# Altium schematic sheet ws2182b LED string.SchDoc
size A4
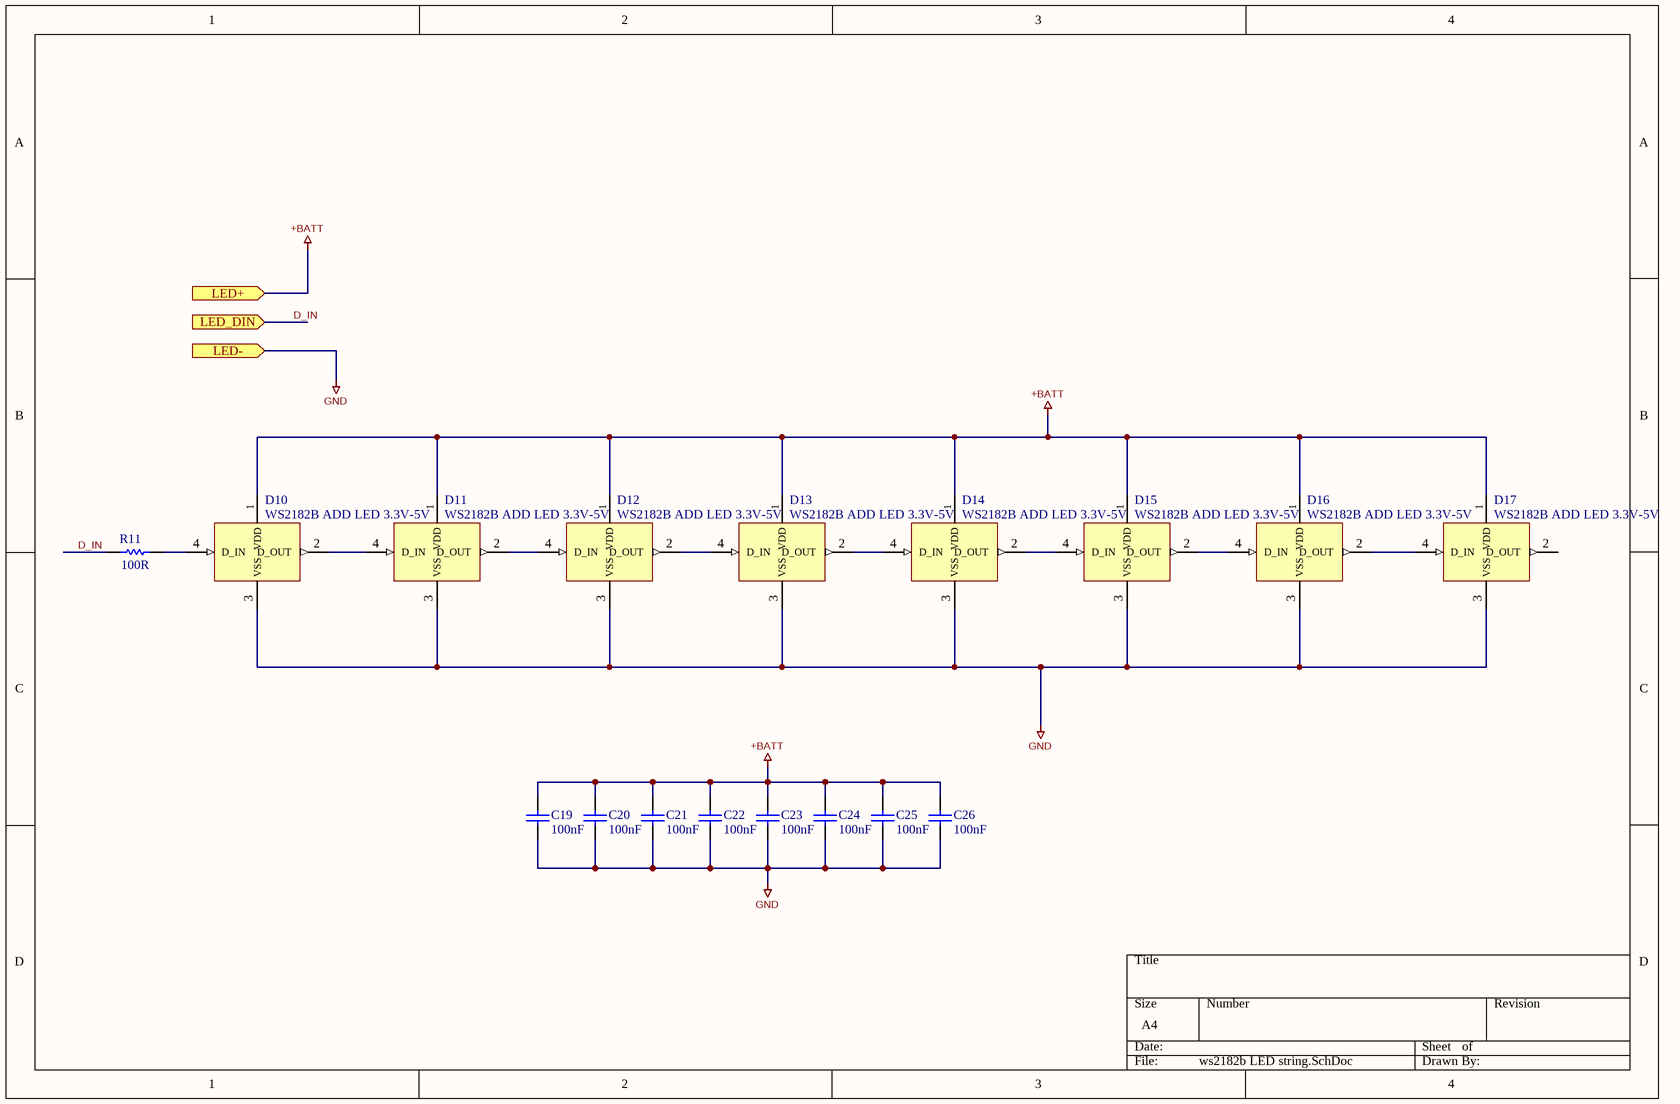
[diagram p0: ws2182b LED string.SchDoc]

## Parts
C19  100nF  [CAPC1608X90X20LL10]
C20  100nF  [CAPC1608X90X20LL10]
C21  100nF  [CAPC1608X90X20LL10]
C22  100nF  [CAPC1608X90X20LL10]
C23  100nF  [CAPC1608X90X20LL10]
C24  100nF  [CAPC1608X90X20LL10]
C25  100nF  [CAPC1608X90X20LL10]
C26  100nF  [CAPC1608X90X20LL10]
D10  WS2182B ADD LED 3.3V-5V  [WS2182B]
D11  WS2182B ADD LED 3.3V-5V  [WS2182B]
D12  WS2182B ADD LED 3.3V-5V  [WS2182B]
D13  WS2182B ADD LED 3.3V-5V  [WS2182B]
D14  WS2182B ADD LED 3.3V-5V  [WS2182B]
D15  WS2182B ADD LED 3.3V-5V  [WS2182B]
D16  WS2182B ADD LED 3.3V-5V  [WS2182B]
D17  WS2182B ADD LED 3.3V-5V  [WS2182B]
R11  100R  [RESC1608X55X25LL10T15]

## Ports
LED+ (in), LED- (in), LED_DIN (in)

## Nets
+BATT: C19.2 C20.2 C21.2 C22.2 C23.2 C24.2 C25.2 C26.2 D10.1(VDD) D11.1(VDD) D12.1(VDD) D13.1(VDD) D14.1(VDD) D15.1(VDD) D16.1(VDD) D17.1(VDD) ; port LED+
GND: C19.1 C20.1 C21.1 C22.1 C23.1 C24.1 C25.1 C26.1 D10.3(VSS) D11.3(VSS) D12.3(VSS) D13.3(VSS) D14.3(VSS) D15.3(VSS) D16.3(VSS) D17.3(VSS) ; port LED-
D_IN: R11.1 ; port LED_DIN
NetD10_2: D10.2(D_OUT) D11.4(D_IN)
NetD10_4: D10.4(D_IN) R11.2
NetD11_2: D11.2(D_OUT) D12.4(D_IN)
NetD12_2: D12.2(D_OUT) D13.4(D_IN)
NetD13_2: D13.2(D_OUT) D14.4(D_IN)
NetD14_2: D14.2(D_OUT) D15.4(D_IN)
NetD15_2: D15.2(D_OUT) D16.4(D_IN)
NetD16_2: D16.2(D_OUT) D17.4(D_IN)

Not connected (* = marked no-connect by the designer): D17 2(D_OUT)

## Library data of the parts
C19-C26 = CMP-2000-07546-1: Chip Capacitor, 0.1 uF, +/- 10%, 50 V, -55 to 125 degC, 0603 (1608 Metric), RoHS, Tape and Reel; Manufacturer: TDK; Voltage: 50V; Dielectric: X7R; Package Reference: 603; Radiation Hardening: No; Composition: Ceramic; Datasheet URL: https://product.tdk.com/info/en/catalog/datasheets/mlcc_automotive_general_en.pdf; Mounting Technology: SurfaceMount; Datasheet Version: 12/2014; Width: 0.8mm; Length: 1.6mm; Capacitance: 100nF; Tolerance: 10%; Case Code (Imperial): 0603; RoHSCompliant: True; Min Operating Temperature: -55degC; Package Description: 2-Pin Surface Mount Device, Body 1.6 x 0.8 mm; Packaging: TapeandReel; Package Quantity: 1; Voltage Rating: 50V; Mount: SurfaceMount; Lead Free: LeadFree; Depth: 0.8mm; Termination: SMD/SMT; Case Code (Metric): 1608; Thickness: 0.035inch; Height: 0.8mm; Weight: 7.1E-05oz; Voltage Rating (DC): 50V; REACH SVHC: NoSVHC; Manufacturer URL: http://www.tdk.com/; Case/Package: 0603; Max Operating Temperature: 125degC
D10-D17 = WS2182B
R11 = CMP-1659-00035-1: General Purpose Chip Resistor, 470 Ohm, +/- 1%, -55 to 155 degC, 0603 (1608 Metric), RoHS, Tape and Reel; Impedance: 50 Ohm; Fastening Type: Snap; Min Operating Temperature: -40 degC; Length: 3 mm; PackageReference: 0603; Contact Material: Brass; Max Operating Temperature: 90 degC; ComponentLink2URL: https://datasheet.ciiva.com/11808/0900766b80f96399-11808177.pdf; Packaging: Tape and Reel; DatasheetVersion: Rev. 4, 04/2009; Contact Plating: Gold; Radiation Hardening: No; Height: 1.25 mm; Resistance: 50 Ohm; RoHSCompliant: true; ComponentLink2Description: Datasheet; Package Quantity: 2500; ComponentLink1URL: http://www.yageo.com/; Width: 3.1 mm; Mount: Surface Mount; PackageDescription: 2-Pin Surface Mount Device, Body 1.6 x 0.8 mm; ComponentLink1Description: Manufacturer URL